# EAGLE design alpha85+mem+acia+pio-routed (EAGLE 9.0.0)
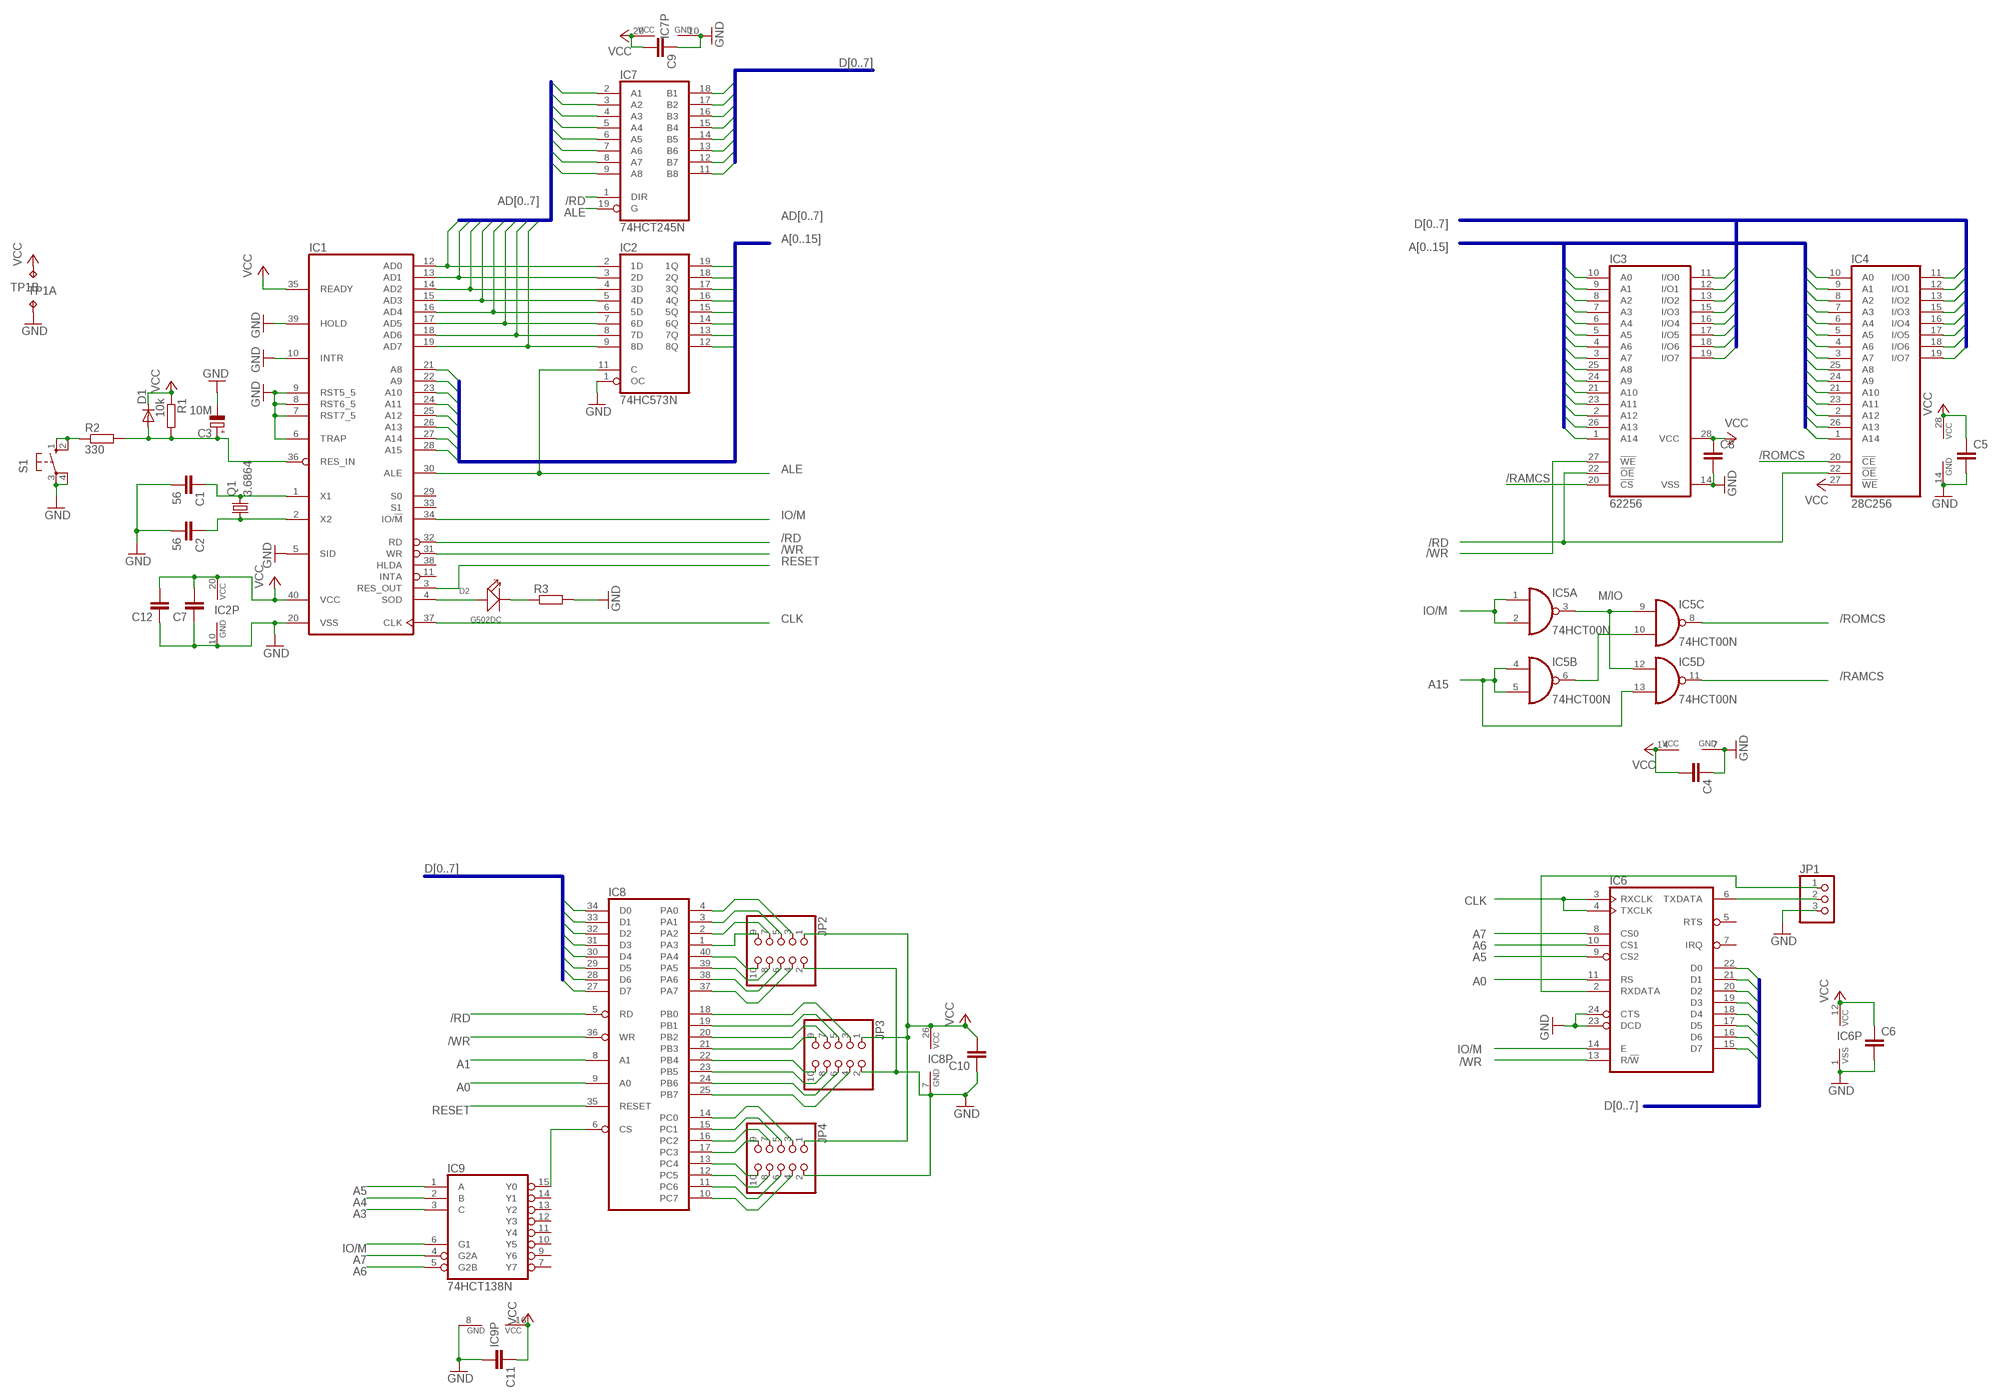
[diagram p0: schematic, sheet 1]

## Parts
C1  56  C-EU025-040X050  [C025-040X050]
C2  56  C-EU025-040X050  [C025-040X050]
C3  10M  CPOL-EUE5-8.5  [E5-8,5]
C4  C-EU050-025X075  [C050-025X075]
C5  C-EU050-025X075  [C050-025X075]
C6  C-EU050-025X075  [C050-025X075]
C7  C-EU050-025X075  [C050-025X075]
C8  C-EU050-025X075  [C050-025X075]
C9  C-EU050-025X075  [C050-025X075]
C10  C-EU050-025X075  [C050-025X075]
C11  C-EU050-025X075  [C050-025X075]
C12  C-EU050-025X075  [C050-025X075]
D1  1N4004  [DO41-10]
D2  G502DC  DIP-LED-GREEN-GREEN(2P-D5MM)  [LED2-2.54-D5.0MM]
IC1  8085  [DIL40]
IC2  74HC573N  [DIL20]
IC3  62256  62256P  [DIL28-6]
IC4  28C256  [DIL28]
IC5  74HCT00N  [DIL14]
IC6  6850  [DIL24]
IC7  74HCT245N  [DIL20]
IC8  8255A  [DIL40]
IC9  74HCT138N  [DIL16]
JP1  PINHD-1X3  [1X03]
JP2  PINHD-2X5  [2X05]
JP3  PINHD-2X5  [2X05]
JP4  PINHD-2X5  [2X05]
Q1  3.6864  CRYSTALHC49S  [HC49/S]
R1  10k  R-EU_0207/10  [0207/10]
R2  330  R-EU_0207/10  [0207/10]
R3  R-EU_0207/7  [0207/7]
S1  40-XX  [B3F-40XX]
TP1  TP2P2-38-17  [P2-38-17]

## Nets
/RAMCS: IC3.20(!CS) IC5.11(D:O)
/RD: IC1.32(RD) IC3.22(!OE) IC4.22(!OE) IC7.1(DIR) IC8.5(RD)
/ROMCS: IC4.20(!CE) IC5.8(C:O)
/WR: IC1.31(WR) IC3.27(!WE) IC6.13(R/!W) IC8.36(WR)
A0: IC2.19(1Q) IC3.10(A0) IC4.10(A0) IC6.11(RS) IC8.9(A0)
A1: IC2.18(2Q) IC3.9(A1) IC4.9(A1) IC8.8(A1)
A2: IC2.17(3Q) IC3.8(A2) IC4.8(A2)
A3: IC2.16(4Q) IC3.7(A3) IC4.7(A3) IC9.3(C)
A4: IC2.15(5Q) IC3.6(A4) IC4.6(A4) IC9.2(B)
A5: IC2.14(6Q) IC3.5(A5) IC4.5(A5) IC6.9(CS2) IC9.1(A)
A6: IC2.13(7Q) IC3.4(A6) IC4.4(A6) IC6.10(CS1) IC9.5(G2B)
A7: IC2.12(8Q) IC3.3(A7) IC4.3(A7) IC6.8(CS0) IC9.4(G2A)
A8: IC1.21(A8) IC3.25(A8) IC4.25(A8)
A9: IC1.22(A9) IC3.24(A9) IC4.24(A9)
A10: IC1.23(A10) IC3.21(A10) IC4.21(A10)
A11: IC1.24(A11) IC3.23(A11) IC4.23(A11)
A12: IC1.25(A12) IC3.2(A12) IC4.2(A12)
A13: IC1.26(A13) IC3.26(A13) IC4.26(A13)
A14: IC1.27(A14) IC3.1(A14) IC4.1(A14)
A15: IC1.28(A15) IC5.4(B:I0) IC5.5(B:I1) IC5.13(D:I1)
ALE: IC1.30(ALE) IC2.11(C) IC7.19(G)
CLK: IC1.37(CLK) IC6.3(RXCLK) IC6.4(TXCLK)
D0: IC3.11(I/O0) IC4.11(I/O0) IC6.22(D0) IC7.18(B1) IC8.34(D0)
D1: IC3.12(I/O1) IC4.12(I/O1) IC6.21(D1) IC7.17(B2) IC8.33(D1)
D2: IC3.13(I/O2) IC4.13(I/O2) IC6.20(D2) IC7.16(B3) IC8.32(D2)
D3: IC3.15(I/O3) IC4.15(I/O3) IC6.19(D3) IC7.15(B4) IC8.31(D3)
D4: IC3.16(I/O4) IC4.16(I/O4) IC6.18(D4) IC7.14(B5) IC8.30(D4)
D5: IC3.17(I/O5) IC4.17(I/O5) IC6.17(D5) IC7.13(B6) IC8.29(D5)
D6: IC3.18(I/O6) IC4.18(I/O6) IC6.16(D6) IC7.12(B7) IC8.28(D6)
D7: IC3.19(I/O7) IC4.19(I/O7) IC6.15(D7) IC7.11(B8) IC8.27(D7)
DX0: IC1.12(AD0) IC2.2(1D) IC7.2(A1)
DX1: IC1.13(AD1) IC2.3(2D) IC7.3(A2)
DX2: IC1.14(AD2) IC2.4(3D) IC7.4(A3)
DX3: IC1.15(AD3) IC2.5(4D) IC7.5(A4)
DX4: IC1.16(AD4) IC2.6(5D) IC7.6(A5)
DX5: IC1.17(AD5) IC2.7(6D) IC7.7(A6)
DX6: IC1.18(AD6) IC2.8(7D) IC7.8(A7)
DX7: IC1.19(AD7) IC2.9(8D) IC7.9(A8)
GND [gnd]: C1.2 C2.2 C3.- C4.1 C5.2 C6.2 C7.1 C8.2 C9.1 C10.1 C11.2 C12.1 IC1.5(SID) IC1.6(TRAP) IC1.7(RST7_5) IC1.8(RST6_5) IC1.9(RST5_5) IC1.10(INTR) IC1.20(VSS) IC1.39(HOLD) IC2.1(OC) IC2.10(GND) IC3.14(VSS) IC4.14(GND) IC5.7(P:GND) IC6.1(VSS) IC6.23(DCD) IC6.24(CTS) IC7.10(GND) IC8.7(GND) IC9.8(GND) JP1.3 JP2.2 JP3.2 JP4.2 R3.2 S1.3(P) S1.4(P1) TP1.TP-1
IO/M: IC1.34(IO/!M) IC5.1(A:I0) IC5.2(A:I1) IC6.14(E) IC9.6(G1)
M/IO: IC5.3(A:O) IC5.9(C:I0) IC5.12(D:I0)
N$1: C1.1 IC1.1(X1) Q1.2
N$2: C2.1 IC1.2(X2) Q1.1
N$3: D2.+ IC1.4(SOD)
N$4: D2.- R3.1
N$5: IC6.6(TXDATA) JP1.2
N$6: C3.+ D1.A IC1.36(RES_IN) R1.2 R2.2
N$7: R2.1 S1.1(S) S1.2(S1)
N$8: IC5.6(B:O) IC5.10(C:I1)
N$9: IC8.1(PA3) JP2.9
N$10: IC6.2(RXDATA) JP1.1
N$11: IC8.2(PA2) JP2.7
N$12: IC8.3(PA1) JP2.5
N$13: IC8.4(PA0) JP2.3
N$14: IC8.40(PA4) JP2.10
N$15: IC8.39(PA5) JP2.8
N$16: IC8.38(PA6) JP2.6
N$17: IC8.37(PA7) JP2.4
N$18: IC8.21(PB3) JP3.9
N$19: IC8.20(PB2) JP3.7
N$20: IC8.19(PB1) JP3.5
N$21: IC8.18(PB0) JP3.3
N$22: IC8.22(PB4) JP3.10
N$23: IC8.23(PB5) JP3.8
N$24: IC8.24(PB6) JP3.6
N$25: IC8.25(PB7) JP3.4
N$26: IC8.17(PC3) JP4.9
N$27: IC8.13(PC4) JP4.10
N$28: IC8.16(PC2) JP4.7
N$29: IC8.15(PC1) JP4.5
N$30: IC8.14(PC0) JP4.3
N$31: IC8.12(PC5) JP4.8
N$32: IC8.11(PC6) JP4.6
N$33: IC8.10(PC7) JP4.4
N$36: IC8.6(CS) IC9.15(Y0)
RESET: IC1.3(RES_OUT) IC8.35(RESET)
VCC [gnd]: C4.2 C5.1 C6.1 C7.2 C8.1 C9.2 C10.2 C11.1 C12.2 D1.C IC1.35(READY) IC1.40(VCC) IC2.20(VCC) IC3.28(VCC) IC4.27(!WE) IC4.28(VCC) IC5.14(P:VCC) IC6.12(VCC) IC7.20(VCC) IC8.26(VCC) IC9.16(VCC) JP2.1 JP3.1 JP4.1 R1.1 TP1.TP-2
Unconnected: IC1.11(INTA) IC1.29(S0) IC1.33(S1) IC1.38(HLDA) IC6.5(RTS) IC6.7(IRQ) IC9.7(Y7) IC9.9(Y6) IC9.10(Y5) IC9.11(Y4) IC9.12(Y3) IC9.13(Y2) IC9.14(Y1)

## Buses
A[0..15]
D[0..7]
AD[0..7]

## Library data of the parts
C1 C2 C4-C12 = rcl:C-EU: CAPACITOR, European symbol
C3 = rcl:CPOL-EU: POLARIZED CAPACITOR, European symbol
D1 = diode:1N4004: DIODE general purpose rectifier, 1 A
D2 = Seeed-LED:DIP-LED-GREEN-GREEN(2P-D5MM): 304090038; MPN: G502DC
IC1 = micro-intel:8085: MICROCOMPUTER/PERIPHERAL DEVICE; OC_FARNELL: unknown; OC_NEWARK: unknown
IC2 = 74xx-eu:74*573: 8-bit D latch BUS DRIVER
IC3 = memory-hitachi:62256P: MEMORY; OC_FARNELL: unknown; OC_NEWARK: unknown
IC4 = memory:28C256: MEMORY
IC5 = 74xx-eu:74*00: Quad 2-input NAND gate
IC6 = micro-motorola:6850: MICROCONTROLLER/MEMORY DEVICE; MF: NTE ELECTRONICS; MPN: NTE6850; OC_FARNELL: 4899775; OC_NEWARK: 31C2457
IC7 = 74xx-eu:74*245: Octal BUS TRANSCEIVER, 3-state
IC8 = micro-intel:8255A: MICROCOMPUTER/PERIPHERAL DEVICE; OC_FARNELL: unknown; OC_NEWARK: unknown
IC9 = 74xx-eu:74*138: 3-line to 8-line DECODER/DEMULTIPLEXER
JP1 = pinhead:PINHD-1X3: PIN HEADER
JP2-JP4 = pinhead:PINHD-2X5: PIN HEADER
Q1 = crystal:CRYSTAL: CRYSTAL; OC_FARNELL: 1667008; OC_NEWARK: unknown
R1-R3 = rcl:R-EU_: RESISTOR, European symbol
S1 = adafruit:40-XX: OMRON SWITCH; MF: OMRON COMPONENTS USA; MPN: B3F-4000; OC_FARNELL: 176434; OC_NEWARK: 36K3105
TP1 = testpad:TP2: Test pad

## Net classes
0 default: width 0.305 mm
1 gnd: width 0.61 mm

## Board
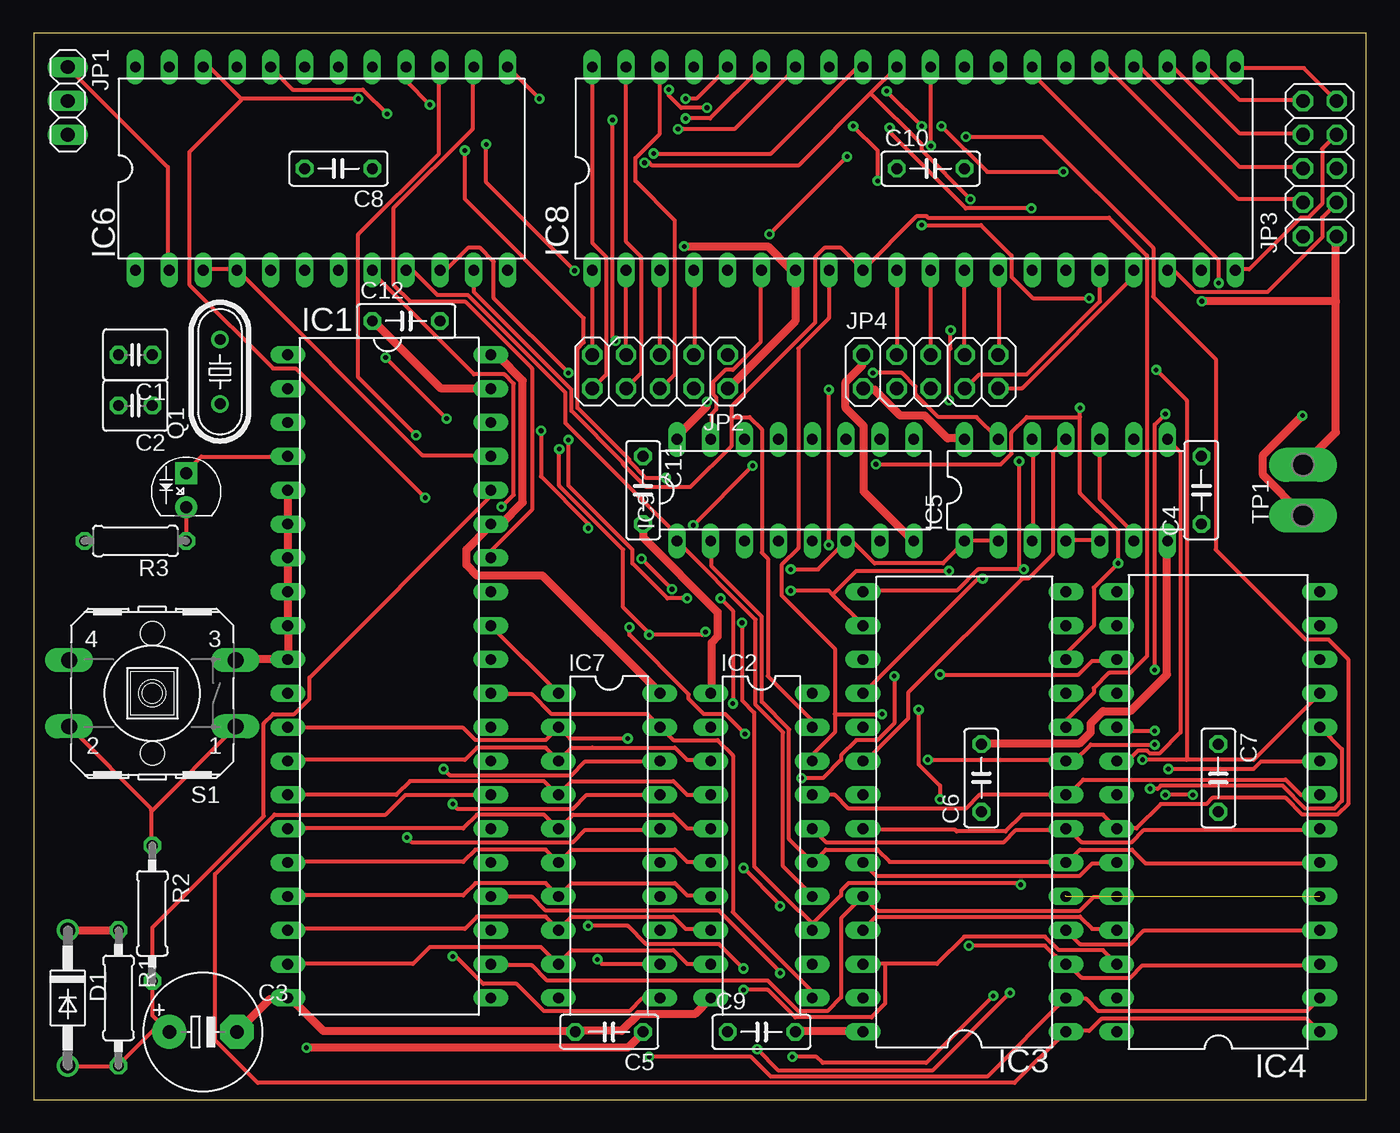
[diagram p1: board, top side]
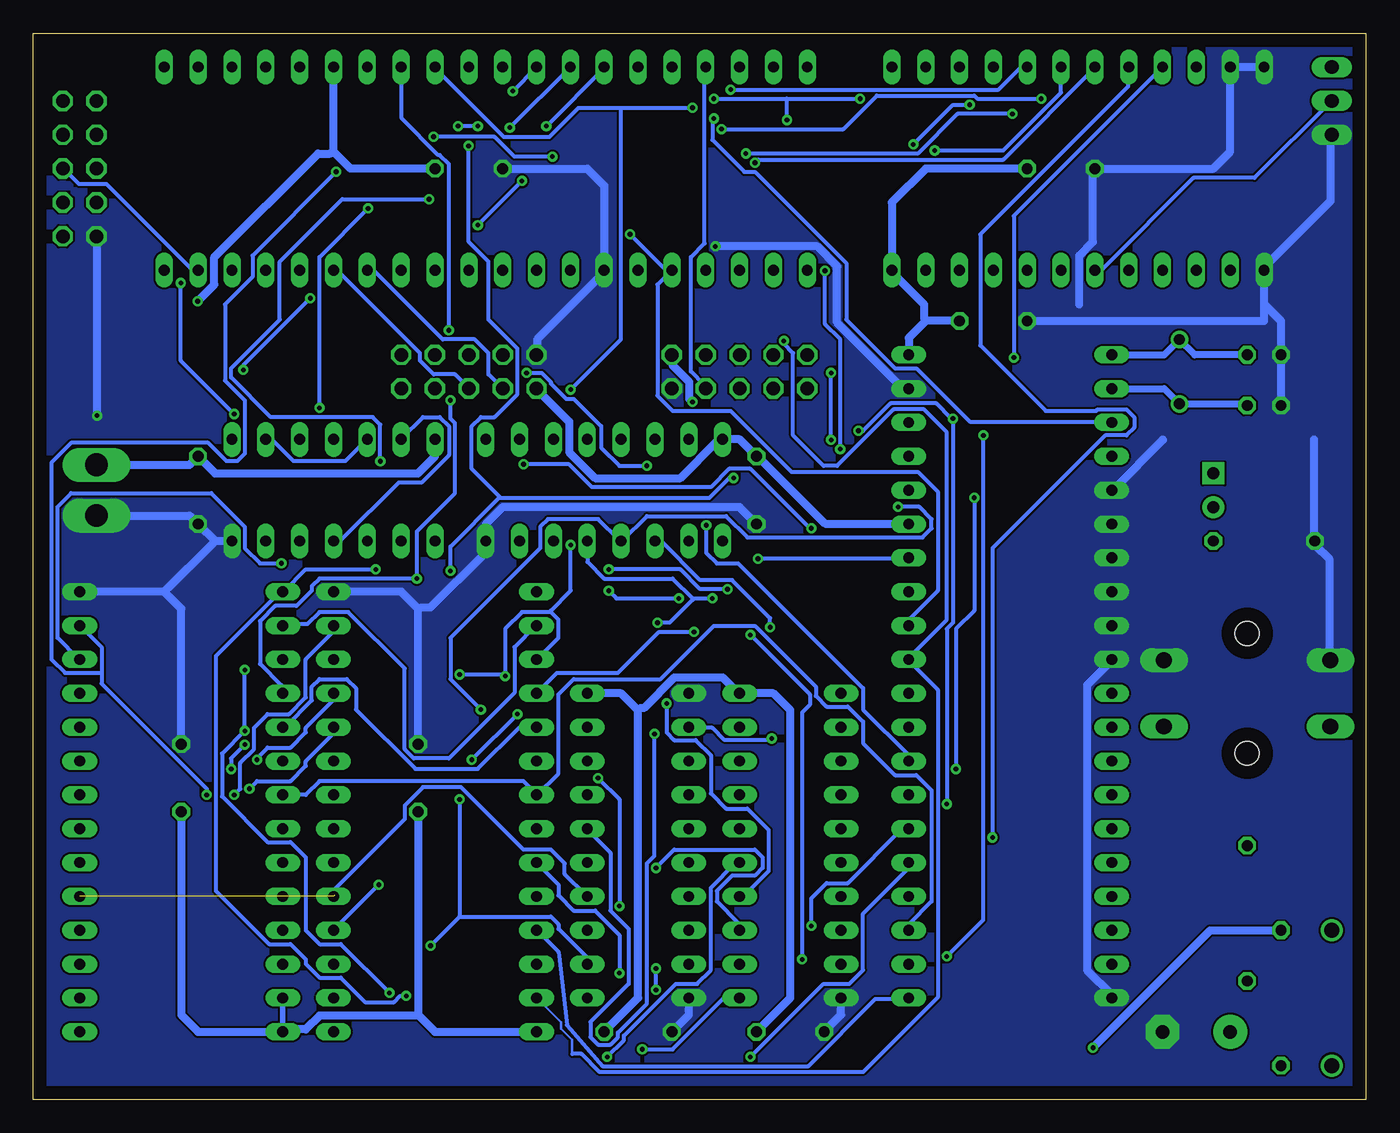
[diagram p2: board, bottom side, seen from below]

Size 100 x 80 mm. Coordinates in mm from the lower left corner, seen from the top.
Outline: 0,0 100,0 100,80 0,80 0,0
Copper layers (1*16): Top 0.035mm / dielectric 1.5mm / Bottom 0.035mm
Design rules "default": minimum track width 6mil, minimum drill 0.35mm, track to track 6mil, track to pad 6mil, pad to pad 6mil, via to via 6mil, smd to smd 6mil, copper to edge 40mil, drill to drill 6mil, minimum pad ring 10mil, minimum via ring 8mil, stop-mask expansion 4mil, vias tented up to drill 0mil, thermal gap 10mil

### Footprints (pad centres in the part's own frame; a part is rotated, then mirrored left to right if it is on the bottom)
C025-040X050 = drill 0.813 octagon: 1 -1.27,0; 2 1.27,0
E5-8,5 = drill 1.016 pad 2.54: + -2.54,0 | drill 1.016 pad 2.54 octagon: - 2.54,0
C050-025X075 = drill 0.813 octagon: 1 -2.54,0; 2 2.54,0
DO41-10 = drill 1.118: A 5.08,0; C -5.08,0
LED2-2.54-D5.0MM = drill 0.889 pad 1.651 square: + -1.27,0 | drill 0.889 pad 1.651: - 1.27,0
DIL40 = drill 0.813 long: 1 -24.13,-7.62; 2 -21.59,-7.62; 3 -19.05,-7.62; 4 -16.51,-7.62; 5 -13.97,-7.62; 6 -11.43,-7.62; 7 -8.89,-7.62; 8 -6.35,-7.62; 9 -3.81,-7.62; 10 -1.27,-7.62; 11 1.27,-7.62; 12 3.81,-7.62; 13 6.35,-7.62; 14 8.89,-7.62; 15 11.43,-7.62; 16 13.97,-7.62; 17 16.51,-7.62; 18 19.05,-7.62; 19 21.59,-7.62; 20 24.13,-7.62; 21 24.13,7.62; 22 21.59,7.62; 23 19.05,7.62; 24 16.51,7.62; 25 13.97,7.62; 26 11.43,7.62; 27 8.89,7.62; 28 6.35,7.62; 29 3.81,7.62; 30 1.27,7.62; 31 -1.27,7.62; 32 -3.81,7.62; 33 -6.35,7.62; 34 -8.89,7.62; 35 -11.43,7.62; 36 -13.97,7.62; 37 -16.51,7.62; 38 -19.05,7.62; 39 -21.59,7.62; 40 -24.13,7.62
DIL20 = drill 0.813 long: 1 -11.43,-3.81; 2 -8.89,-3.81; 3 -6.35,-3.81; 4 -3.81,-3.81; 5 -1.27,-3.81; 6 1.27,-3.81; 7 3.81,-3.81; 8 6.35,-3.81; 9 8.89,-3.81; 10 11.43,-3.81; 11 11.43,3.81; 12 8.89,3.81; 13 6.35,3.81; 14 3.81,3.81; 15 1.27,3.81; 16 -1.27,3.81; 17 -3.81,3.81; 18 -6.35,3.81; 19 -8.89,3.81; 20 -11.43,3.81
DIL28-6 = drill 0.813 long: 1 -16.51,-7.62; 2 -13.97,-7.62; 3 -11.43,-7.62; 4 -8.89,-7.62; 5 -6.35,-7.62; 6 -3.81,-7.62; 7 -1.27,-7.62; 8 1.27,-7.62; 9 3.81,-7.62; 10 6.35,-7.62; 11 8.89,-7.62; 12 11.43,-7.62; 13 13.97,-7.62; 14 16.51,-7.62; 15 16.51,7.62; 16 13.97,7.62; 17 11.43,7.62; 18 8.89,7.62; 19 6.35,7.62; 20 3.81,7.62; 21 1.27,7.62; 22 -1.27,7.62; 23 -3.81,7.62; 24 -6.35,7.62; 25 -8.89,7.62; 26 -11.43,7.62; 27 -13.97,7.62; 28 -16.51,7.62
DIL28 = drill 0.813 long: 1 -16.51,-7.62; 2 -13.97,-7.62; 3 -11.43,-7.62; 4 -8.89,-7.62; 5 -6.35,-7.62; 6 -3.81,-7.62; 7 -1.27,-7.62; 8 1.27,-7.62; 9 3.81,-7.62; 10 6.35,-7.62; 11 8.89,-7.62; 12 11.43,-7.62; 13 13.97,-7.62; 14 16.51,-7.62; 15 16.51,7.62; 16 13.97,7.62; 17 11.43,7.62; 18 8.89,7.62; 19 6.35,7.62; 20 3.81,7.62; 21 1.27,7.62; 22 -1.27,7.62; 23 -3.81,7.62; 24 -6.35,7.62; 25 -8.89,7.62; 26 -11.43,7.62; 27 -13.97,7.62; 28 -16.51,7.62
DIL14 = drill 0.813 long: 1 -7.62,-3.81; 2 -5.08,-3.81; 3 -2.54,-3.81; 4 0,-3.81; 5 2.54,-3.81; 6 5.08,-3.81; 7 7.62,-3.81; 8 7.62,3.81; 9 5.08,3.81; 10 2.54,3.81; 11 0,3.81; 12 -2.54,3.81; 13 -5.08,3.81; 14 -7.62,3.81
DIL24 = drill 0.813 long: 1 -13.97,-7.62; 2 -11.43,-7.62; 3 -8.89,-7.62; 4 -6.35,-7.62; 5 -3.81,-7.62; 6 -1.27,-7.62; 7 1.27,-7.62; 8 3.81,-7.62; 9 6.35,-7.62; 10 8.89,-7.62; 11 11.43,-7.62; 12 13.97,-7.62; 13 13.97,7.62; 14 11.43,7.62; 15 8.89,7.62; 16 6.35,7.62; 17 3.81,7.62; 18 1.27,7.62; 19 -1.27,7.62; 20 -3.81,7.62; 21 -6.35,7.62; 22 -8.89,7.62; 23 -11.43,7.62; 24 -13.97,7.62
DIL16 = drill 0.813 long: 1 -8.89,-3.81; 2 -6.35,-3.81; 3 -3.81,-3.81; 4 -1.27,-3.81; 5 1.27,-3.81; 6 3.81,-3.81; 7 6.35,-3.81; 8 8.89,-3.81; 9 8.89,3.81; 10 6.35,3.81; 11 3.81,3.81; 12 1.27,3.81; 13 -1.27,3.81; 14 -3.81,3.81; 15 -6.35,3.81; 16 -8.89,3.81
1X03 = drill 1.016 long: 1 -2.54,0; 2 0,0; 3 2.54,0
2X05 = drill 1.016 octagon: 1 -5.08,-1.27; 2 -5.08,1.27; 3 -2.54,-1.27; 4 -2.54,1.27; 5 0,-1.27; 6 0,1.27; 7 2.54,-1.27; 8 2.54,1.27; 9 5.08,-1.27; 10 5.08,1.27
HC49/S = drill 0.813: 1 -2.413,0; 2 2.413,0
0207/10 = drill 0.813 octagon: 1 -5.08,0; 2 5.08,0
0207/7 = drill 0.813 octagon: 1 -3.81,0; 2 3.81,0
B3F-40XX = drill 1.194 long: 1 -6.248,2.489; 2 6.248,2.489; 3 -6.248,-2.489; 4 6.248,-2.489 | hole 1.803: 0,-4.496; 0,4.496
P2-38-17 = drill 1.702 pad 2.121 long: TP-1 -1.905,0; TP-2 1.905,0

### Placement (x,y rotation side)
C1  7.62,55.88 180 top
C2  7.62,52.07 180 top
C3  12.7,5.08 0 top
C4  87.63,45.72 90 top
C5  43.18,5.08 180 top
C6  71.12,24.13 90 top
C7  88.9,24.13 270 top
C8  22.86,69.85 180 top
C9  54.61,5.08 0 top
C10  67.31,69.85 0 top
C11  45.72,45.72 270 top
C12  27.94,58.42 0 top
D1  2.54,7.62 270 top
D2  11.43,45.72 270 top
IC1  26.67,31.75 270 top
IC2  54.61,19.05 270 top
IC3  69.85,21.59 90 top
IC4  88.9,21.59 90 top
IC5  77.47,45.72 0 top
IC6  21.59,69.85 0 top
IC7  43.18,19.05 270 top
IC8  66.04,69.85 0 top
IC9  57.15,45.72 0 top
JP1  2.54,74.93 270 top
JP2  46.99,54.61 180 top
JP3  96.52,69.85 90 top
JP4  67.31,54.61 0 top
Q1  13.97,54.61 90 top
R1  6.35,7.62 270 top
R2  8.89,13.97 270 top
R3  7.62,41.91 180 top
S1  8.89,30.48 180 top
TP1  95.25,45.72 90 top

### Tracks (layer width: path | path; a pad name or v marks a point on that pad's centre or on a via)
/RAMCS
  Top 0.305: IC3.20 62.29,25.49 62.52,25.49 65.61,28.57 65.61,30.52 74.18,39.09 74.64,39.09 76.47,40.92 76.47,48.58 77.38,49.49 IC5.11
/RD  (via drill 0.35)
  Top 0.305: IC3.22 62.29,20.23 69.15,20.23 69.27,20.12 72.92,20.12 74.18,21.37 80.24,21.37 81.27,20.34 IC4.22 81.38,20.34 82.75,20.34 84.58,22.17 88.01,22.17 88.47,22.63 93.95,22.63 95.21,21.37 97.84,21.37 98.64,22.17 98.64,33.03 97.16,34.52 95.44,34.52 88.7,41.26 88.7,55.55 84.01,60.24 84.01,63.89 75.67,72.24 v69.95,72.24 | v55.21,64.92 v61.04,70.75 | IC1.32 IC7.1
  Bottom 0.305: IC1.32 34.29,36.01 32.12,38.18 32.12,45.61 33.6,47.09 43.09,47.09 47.66,51.66 52.01,51.66 53.15,52.81 53.15,61.15 IC8.5 52.35,62.06 v55.21,64.92 | v69.95,72.24 65.38,72.24 63.89,70.75 v61.04,70.75
/ROMCS
  Top 0.305: IC4.20 81.38,25.49 82.18,25.49 82.87,26.18 83.55,26.18 83.78,25.95 84.47,25.95 86.07,27.55 86.07,48.58 85.15,49.49 IC5.8
/WR  (via drill 0.35)
  Top 0.305: v37.95,75.09 35.66,77.38 IC6.13 | v48.92,75.09 49.72,75.09 52.01,77.38 IC8.36 | 34.29,32.92 IC1.31 | v43.43,73.5 43.43,57.15 v43.66,56.92
  Bottom 0.203: 59.55,3.43 59.55,4.47 60.4,5.32 60.4,5.79 IC3.27
  Bottom 0.305: v48.92,75.09 43.43,75.09 | 43.43,75.09 v37.95,75.09 | 59.55,3.43 58.86,3.43 57.49,2.06 37.72,2.06 32.12,7.66 32.12,30.75 34.29,32.92 IC1.31 34.29,33.15 31.43,36.01 31.43,50.06 33.15,51.78 35.43,51.78 39.66,47.55 40.69,47.55 42.98,49.84 42.98,56.01 43.66,56.69 v43.66,56.92 | v43.43,73.5 43.43,75.09
A0  (via drill 0.35)
  Top 0.305: v83.78,23.32 84.35,23.32 84.58,23.55 93.73,23.55 95.44,21.83 97.61,21.83 98.18,22.4 98.18,26.29 96.58,27.89 IC4.10 | 52.35,51.21 52.35,52.01 58.64,58.29 58.64,63.21 59.32,63.89 60.58,63.89 62.18,62.29 IC8.9 66.29,66.29 66.98,66.29 67.09,66.18 80.7,66.18 83.55,63.32 83.55,33.26 82.3,32 80.7,32 79.55,30.86 79.55,30.52 77.5,28.46 77.5,28 IC3.10 | 52.35,51.21 52.35,49.03 49.26,45.95 45.95,45.95 44.23,47.66 44.23,47.78 40.35,51.66 40.35,53.26 33.03,60.58 33.03,62.18 IC6.11 | 52.35,51.21 53.72,51.21 54.63,50.29 54.63,41.03 55.09,40.58 55.09,31.77 58.41,28.46 58.41,28 IC2.19
  Bottom 0.305: v83.78,23.32 83.21,23.89 80.7,23.89 79.55,25.03 79.55,25.38 77.5,27.43 77.5,27.89 IC3.10
A1  (via drill 0.35)
  Top 0.305: 60.12,28.92 60.12,33.83 56.12,37.83 56.12,40.12 57.38,41.38 57.38,56.35 59.66,58.64 59.66,62.18 IC8.8 | 60.12,28.92 60.12,27.55 58.52,25.95 58.52,25.49 IC2.18 | v67.09,25.49 77.38,25.49 IC3.9 77.61,25.38 78.07,25.38 79.32,26.63 v84.12,26.63 | 60.12,28.92 v63.66,28.92 | v85.15,24.8 91.55,24.8 92.13,25.38 96.47,25.38 IC4.9
  Bottom 0.305: v63.66,28.92 v67.09,25.49 | v85.15,24.8 85.15,25.6 v84.12,26.63
A2
  Top 0.305: IC2.17 60.12,22.86 61.15,21.83 69.95,21.83 70.98,22.86 IC3.8 77.61,22.86 78.75,24 93.95,24 95.1,22.86 IC4.8
A3  (via drill 0.35)
  Top 0.305: v44.69,35.43 44.69,34.86 49.15,30.4 49.15,30.06 50.29,28.92 51.89,28.92 v53.38,27.43 | IC2.16 58.52,20.23 59.44,19.32 72.81,19.32 73.72,20.23 77.38,20.23 IC3.7 77.61,20.34 78.64,19.32 82.41,19.32 83.33,20.23 96.47,20.23 IC4.7
  Bottom 0.305: v44.69,35.43 44.69,36.12 47.55,38.98 49.95,38.98 52.81,41.83 53.26,41.83 IC9.3 | v53.38,27.43 53.38,18.29 53.95,17.72 53.95,7.2 56.12,5.03 56.12,4.69 56.69,4.12 57.61,4.12 58.18,4.69 58.18,5.83 55.32,8.69 55.32,12.8 56.69,14.17 56.69,18.52 58.41,20.23 IC2.16
A4
  Top 0.305: 96.47,17.72 IC4.6 96.36,17.72 83.44,17.72 82.41,18.75 78.52,18.75 77.61,17.83 IC3.6 77.38,17.83 64.24,17.83 63.32,18.75 59.44,18.75 58.52,17.83 IC2.15 58.41,17.83 56.69,19.55 56.69,27.77 54.63,29.83 54.63,36.23 50.86,40.01 50.86,41.83 IC9.2
A5  (2 unrouted)
  Top 0.305: IC2.14 58.41,15.32 56.24,17.49 56.24,27.55 54.18,29.6 54.18,36.01 48.35,41.83 IC9.1 48.12,41.95 48.12,42.52 39.89,50.75 39.89,53.03 32.58,60.35 30.29,60.35 28.46,62.18 28,62.18 IC6.9
  Bottom 0.305: 77.38,15.32 77.38,15.77 72.12,21.03 72.12,22.06 70.75,23.43 67.89,23.43 63.21,18.75 61.15,18.75 60.12,17.72 60.12,16.92 58.52,15.32 IC2.14
A6  (via drill 0.35)
  Top 0.305: v74.07,16.12 73.95,16.23 61.15,16.23 60.58,15.66 60.58,15.32 58.52,13.26 58.52,12.8 IC2.13 58.41,13.26 57.49,14.17 57.38,14.17 54.06,17.49 54.06,29.03 53.15,29.95 v53.15,35.78 | IC4.4 96.47,12.69 83.33,12.69 82.3,11.66 78.52,11.66 77.5,12.69 IC3.4 | v40.12,54.52 34.52,60.12 34.52,62.87 33.49,63.89 32.58,63.89 30.98,62.29 30.52,62.29 IC6.10 | v40.12,49.49 40.12,46.06 44.92,41.26 44.92,40.23 47.55,37.6 v49.03,37.6
  Bottom 0.305: v74.07,16.12 77.38,12.8 IC3.4 | v40.12,49.49 v40.12,54.52 | 50.52,37.6 v49.03,37.6 | 50.52,37.6 52.01,39.09 57.15,39.09 58.41,40.35 58.41,41.83 IC9.5 | v53.15,35.78 52.23,35.78 50.52,37.49 50.52,37.6
A7  (via drill 0.35)
  Top 0.305: v70.18,11.54 75.89,11.54 77.38,10.06 IC3.3 77.61,10.17 78.64,9.14 82.3,9.14 83.21,10.06 96.47,10.06 IC4.3 | v35.09,44.46 36.01,45.38 36.01,53.72 35.32,54.41 33.03,54.41 25.49,61.95 25.49,62.18 IC6.8 | v68.01,22.52 68.01,23.55 66.41,25.15 v66.41,29.26
  Bottom 0.305: 68.01,13.72 61.15,13.72 60.58,13.14 60.58,12.8 58.52,10.74 58.52,10.17 IC2.12 | v70.18,11.54 68.01,13.72 | v35.09,44.46 33.49,44.46 32.58,43.55 32.58,42.86 33.26,42.18 46.41,42.18 48.01,43.78 53.95,43.78 55.78,41.95 IC9.4 56.01,41.95 57.61,43.55 61.38,43.55 61.95,42.98 61.95,41.38 68.69,34.63 68.69,31.55 v66.41,29.26 | v68.01,22.52 68.01,13.72
A8
  Top 0.305: IC4.25 81.27,12.8 79.44,12.8 78.52,13.72 63.21,13.72 62.29,12.8 IC3.25
  Bottom 0.305: IC1.21 34.29,7.54 36.8,7.54 41.83,2.52 57.26,2.52 59.94,5.58 60.58,11.09 62.18,12.69 IC3.25
A9
  Top 0.305: IC1.22 34.29,10.06 37.38,10.06 38.52,8.91 55.09,8.91 57.38,6.63 59.55,6.63 60.58,7.66 60.58,13.6 62.18,15.2 IC3.24 62.29,15.2 63.32,14.17 78.52,14.17 79.55,15.2 81.27,15.2 IC4.24
A10
  Bottom 0.305: IC1.23 34.29,13.14 32.58,14.86 32.58,23.2 33.72,24.35 35.32,24.35 37.72,26.75 37.72,28.35 38.86,29.49 40.46,29.49 41.26,30.29 41.26,30.98 45.83,35.55 48.92,35.55 52.92,31.55 59.44,31.55 60.58,30.4 60.58,24.46 62.18,22.86 IC3.21 62.29,22.97 63.21,23.89 78.52,23.89 79.55,22.86 IC4.21
A11  (via drill 0.35)
  Top 0.305: v56.01,9.49 56.01,9.6 51.44,14.17 38.41,14.17 37.38,15.2 34.29,15.2 IC1.24 | IC3.23 63.21,16.8 78.52,16.8 79.44,17.72 81.27,17.72 IC4.23
  Bottom 0.305: v56.01,9.49 56.01,12.34 57.84,14.17 59.44,14.17 60.58,15.32 60.58,16.12 62.18,17.72 IC3.23
A12  (via drill 0.35)
  Top 0.305: IC4.2 96.47,7.54 95.56,6.63 79.9,6.63 78.98,7.54 77.5,7.54 IC3.2 77.38,7.54 71.55,1.71 55.32,1.71 53.84,3.2 v46.18,3.2
  Bottom 0.305: IC1.25 34.29,17.37 37.72,13.95 37.72,9.72 38.75,8.69 40.69,8.69 v46.18,3.2
A13  (via drill 0.35)
  Top 0.305: 63.89,10.17 67.78,10.17 69.84,12.23 75.89,12.23 76.92,11.2 80.24,11.2 IC4.26 | 63.89,10.17 62.29,10.17 IC3.26 | v41.6,13.03 44.58,13.03 45.95,11.66 51.44,11.66 v53.26,9.83 | v53.26,8.23 55.09,8.23 57.15,6.17 62.87,6.17 63.89,7.2 63.89,10.17
  Bottom 0.305: v41.6,13.03 41.6,15.09 40.46,16.23 38.86,16.23 34.86,20.23 34.29,20.23 IC1.26 | v53.26,8.23 v53.26,9.83
A14
  Top 0.305: IC4.1 96.47,5.14 95.56,6.06 80.12,6.06 79.21,5.14 77.5,5.14 IC3.1 77.38,5.03 73.61,1.26 16.8,1.26 13.6,4.46 13.6,16.92 18.06,21.37 26.4,21.37 27.89,22.86 IC1.27
A15  (via drill 0.35)
  Top 0.305: IC5.4 77.5,41.95 80.01,41.95 IC5.5 | v53.95,47.55 v49.49,43.09 | v62.98,54.52 65.15,54.52 66.18,53.49 66.18,52.92 67.89,51.21 70.75,51.21 72.35,49.61 IC5.13
  Bottom 0.305: IC1.28 34.29,25.83 37.72,29.26 37.72,30.86 47.09,40.23 48.69,40.23 49.49,41.03 v49.49,43.09 | v53.95,47.55 56.01,47.55 57.38,48.92 57.38,50.52 59.44,52.58 60.01,52.58 61.15,53.72 61.15,53.84 61.84,54.52 v62.98,54.52 | IC5.4 77.38,41.95 76.92,41.95 72.58,46.29 70.87,46.29 68.81,48.35 68.81,50.52 69.49,51.21 70.75,51.21 72.35,49.61 IC5.13
ALE
  Top 0.305: IC1.30 34.29,30.4 37.38,30.4 38.86,28.92 46.06,28.92 46.98,28 IC7.19 47.09,27.89 48.01,26.98 51.32,26.98 52.46,25.83 52.46,14.06 58.41,8.12 58.41,7.66 IC2.11
CLK
  Top 0.305: IC6.3 12.8,62.29 15.2,62.29 IC6.4 15.32,62.18 29.15,48.35 34.29,48.35 IC1.37
D0  (via drill 0.35)
  Top 0.305: 86.53,25.49 91.55,25.49 96.47,30.4 IC4.11 | 86.53,25.49 v83.21,25.49 | 15.54,75.09 13.26,77.38 12.8,77.38 IC6.22 | v24.35,75.09 15.54,75.09 | v48.35,72.81 52.58,72.81 57.15,77.38 IC8.34 | v30.75,24.8 31.2,24.35 40.35,24.35 41.38,25.38 46.98,25.38 IC7.18 | v29.38,45.15 19.66,54.86 17.95,54.86 11.66,61.15 11.66,71.09 15.54,74.98 15.54,75.09 | 86.53,25.49 86.53,52.46 v84.24,54.75 | v79.21,60.12 74.98,60.12 73.38,61.72 73.38,63.32 71.09,65.61 v66.64,65.61 | v63.32,68.92 63.32,71.21 v61.49,73.04
  Bottom 0.305: v83.21,25.49 83.21,25.6 82.41,26.4 80.7,26.4 79.55,27.55 79.55,27.89 77.5,29.95 77.5,30.4 IC3.11 | v24.35,75.09 29.15,75.09 29.38,75.32 36.69,75.32 39.2,72.81 v48.35,72.81 | v30.75,24.8 30.75,35.32 29.38,36.69 v29.38,45.15 | v84.24,54.75 84.24,55.09 v79.21,60.12 | v63.32,68.92 v66.64,65.61 | v61.49,73.04 57.15,77.38 IC8.34
D1  (via drill 0.35)
  Top 0.305: IC3.12 77.5,33.03 77.5,33.49 79.55,35.55 79.55,38.41 v81.38,40.23 81.38,42.63 78.52,45.49 78.52,51.21 | v64.24,72.92 64.24,72.58 69.95,66.86 v74.87,66.86 | 78.52,51.21 v78.52,51.89 | IC7.17 41.49,22.86 40.46,21.83 31.77,21.83 v31.43,22.17 | v26.4,55.66 v30.98,51.09 | 78.52,51.21 74.52,51.21 73.38,50.06 73.38,48.46 72.58,47.66 v63.21,47.66 | v41.6,42.86 41.6,43.2 38.06,46.75 v38.06,50.18
  Bottom 0.305: v81.38,40.23 82.98,40.23 84.12,41.38 84.12,42.98 86.64,45.49 97.16,45.49 98.18,44.46 98.18,34.63 96.58,33.03 IC4.12 | v64.24,72.92 IC8.33 | v74.87,66.86 78.52,63.21 v78.52,51.89 | v31.43,22.17 31.43,35.32 30.98,35.78 v30.98,51.09 31.09,51.09 32.23,52.23 35.66,52.23 37.72,50.18 v38.06,50.18 | v26.4,55.66 26.4,66.29 15.32,77.38 IC6.21 | v63.21,47.66 59.78,47.66 58.06,45.95 49.15,45.95 47.78,47.32 46.18,47.32 41.72,42.86 v41.6,42.86
D2  (via drill 0.35)
  Top 0.305: v86.98,22.86 v84.92,22.86 | v28,19.66 28.35,19.32 40.46,19.32 41.38,20.23 46.98,20.23 IC7.16 | v46.52,70.98 55.32,70.98 61.72,77.38 62.18,77.38 IC8.32 | v26.52,73.95 24.69,75.78 19.43,75.78 17.83,77.38 IC6.20 | v77.27,69.61 71.55,69.61 v68.12,73.04 | v64.01,75.67 v66.64,73.04
  Bottom 0.305: v84.92,22.86 84.47,23.32 84.47,25.26 83.44,26.29 83.44,27.89 82.41,28.92 80.81,28.92 79.55,30.18 79.55,33.03 77.5,35.09 77.5,35.55 IC3.13 | v86.98,22.86 86.98,23.32 94.87,31.2 94.87,32 | 94.87,32 94.87,33.95 96.47,35.55 IC4.13 | v28,19.66 28,41.38 19.55,49.84 17.95,49.84 17.37,50.41 17.37,51.21 17.95,51.78 20.12,51.78 20.23,51.66 24,51.66 28.92,56.58 28.92,64.92 17.83,76.01 17.83,77.38 IC6.20 | v46.52,70.98 33.6,70.98 30.63,73.95 v26.52,73.95 | 94.87,32 97.61,32 98.64,33.03 98.64,47.78 97.16,49.26 86.87,49.26 85.5,47.89 84.7,47.89 84.12,48.46 84.12,52.46 85.61,53.95 85.61,59.66 83.55,61.72 83.55,63.32 v77.27,69.61 | v66.64,73.04 v68.12,73.04 | v64.01,75.67 62.29,77.38 IC8.32
D3  (via drill 0.35)
  Top 0.305: v45.83,70.29 46.18,70.29 46.41,70.07 57.38,70.07 62.81,75.5 | 62.81,75.5 64.69,77.38 IC8.31 | v56.92,3.2 58.75,3.2 59.21,2.74 66.98,2.74 v72.01,7.77 | IC3.15 62.29,38.18 69.27,38.18 70.87,39.78 v74.3,39.78 73.95,39.89 v73.95,47.89 | 62.81,75.5 66.64,71.67 66.64,71.21 v70.29,67.55
  Bottom 0.305: v45.83,70.29 45.61,70.52 27.2,70.52 20.34,77.38 IC6.19 | v56.92,3.2 55.66,4.46 55.66,4.8 51.78,8.69 50.18,8.69 49.15,9.72 49.15,15.89 47.32,17.72 47.09,17.72 IC7.15 | v72.01,7.77 72.47,7.77 72.92,7.32 75.09,7.32 76.92,9.14 78.52,9.14 79.55,10.17 79.55,10.52 80.7,11.66 82.3,11.66 86.3,15.66 86.3,33.26 81.38,38.18 IC4.15 81.15,38.18 79.55,39.78 v74.3,39.78 | v70.29,67.55 76.81,67.55 81.5,62.87 81.5,58.52 85.15,54.86 85.15,54.18 82.18,51.21 74.52,51.21 73.95,50.63 v73.95,47.89
D4  (via drill 0.35)
  Top 0.305: v52.46,29.72 52.46,36.69 v51.55,37.6 | v56.81,38.18 59.66,38.18 59.95,37.89 | 59.95,37.89 62.18,35.66 IC3.16 | v32.35,71.21 32.35,67.55 41.26,58.64 41.26,56.81 40.8,56.35 40.8,51.89 44.69,48.01 44.69,47.89 45.95,46.63 v47.43,46.63 | v68.69,39.66 61.72,39.66 59.95,37.89 | v67.32,71.55 67.32,77.38 IC8.30
  Bottom 0.305: v52.46,29.72 52.46,27.55 51.89,26.98 50.29,26.98 49.15,25.83 49.15,22.97 48.01,21.83 46.41,21.83 44.81,20.23 44.81,17.14 46.63,15.32 46.98,15.32 IC7.14 | v51.55,37.6 56.24,37.6 v56.81,38.18 | IC6.18 22.86,75.55 27.2,71.21 v32.35,71.21 | v47.43,46.63 47.78,46.63 49.26,45.15 65.04,45.15 | 65.04,45.15 68.69,41.49 v68.69,39.66 | IC4.16 81.27,35.66 79.44,35.66 78.52,36.58 76.35,36.58 72.12,32.35 72.12,26.29 71.44,25.6 68.81,25.6 63.89,30.52 63.89,33.95 62.29,35.55 IC3.16 | v67.32,71.55 67.32,64.35 65.84,62.87 65.84,58.52 63.66,56.35 63.66,52.92 65.38,51.21 66.41,51.21 67.09,50.52 67.09,47.32 65.04,45.26 65.04,45.15
D5  (via drill 0.35)
  Top 0.305: v47.66,75.78 47.66,75.32 48.58,74.41 v50.52,74.41 | v53.26,17.37 56.01,14.63 v56.01,14.52 | v57.61,24.12 59.21,24.12 60.58,25.49 60.58,25.83 61.72,26.98 63.32,26.98 64.58,28.23 v64.58,31.77 | v68.01,31.89 78.41,31.89 79.44,32.92 81.27,32.92 IC4.17 | v59.66,41.6 v59.66,53.26
  Bottom 0.305: v47.66,75.78 27.55,75.78 25.95,77.38 25.49,77.38 IC6.17 | 55.89,74.41 59.09,74.41 61.27,72.24 64.69,72.24 69.84,77.38 IC8.29 | 55.89,74.41 v50.52,74.41 | v53.26,17.37 51.89,18.75 45.83,18.75 45.26,18.17 45.26,17.37 45.83,16.8 47.55,16.8 48.69,15.66 48.69,14.86 47.09,13.26 47.09,12.8 IC7.13 | v56.01,14.52 56.01,22.52 v57.61,24.12 | 61.15,36.58 63.32,36.58 64.58,35.32 v64.58,31.77 64.69,31.89 v68.01,31.89 | 61.15,36.58 60.58,36.01 60.58,34.63 62.18,33.03 IC3.17 | 55.89,74.41 55.89,57.04 v59.66,53.26 | v59.66,41.6 59.66,38.18 61.15,36.69 61.15,36.58
D6  (via drill 0.35)
  Top 0.305: v42.29,10.52 42.63,10.17 46.98,10.17 IC7.12 | v50.41,35.09 50.18,34.86 v46.18,34.86 46.18,34.98 44.23,36.92 44.23,41.26 39.43,46.06 v39.43,48.81 | v71.21,39.09 70.87,39.09 62.29,30.52 IC3.18 | v29.72,74.64 28,76.35 28,77.38 IC6.16 | v33.95,71.67 33.95,68.81 v40.58,62.18 | v68.81,57.72 68.81,56.35 68.69,56.24 v68.69,52.46
  Bottom 0.305: v42.29,10.52 42.29,29.03 41.72,29.6 41.72,30.4 v46.18,34.86 | v50.41,35.09 53.03,35.09 56.12,32 60.69,32 62.18,30.52 IC3.18 | IC4.18 81.38,30.52 81.38,31.09 82.98,32.69 82.98,35.89 81.84,37.03 80.24,37.03 79.1,38.18 79.1,38.52 78.52,39.09 v71.21,39.09 71.21,42.63 68.35,45.49 68.35,50.75 68.69,51.09 v68.69,52.46 | v29.72,74.64 30.98,74.64 v33.95,71.67 | v40.58,62.18 40.58,58.18 39.43,57.04 v39.43,48.81 | v68.81,57.72 68.81,70.18 69.49,70.87 69.61,70.87 72.35,73.61 72.35,77.38 IC8.28
D7  (via drill 0.35)
  Top 0.305: v54.29,3.77 55.89,2.17 67.44,2.17 v73.27,8 | v84.12,27.66 81.61,27.66 81.38,27.89 IC4.19 | v28.69,49.84 24.35,54.18 24.35,64.92 30.4,70.98 30.4,77.38 IC6.15 | v31.43,10.74 31.66,10.74 33.72,8.69 36.23,8.69 38.29,6.63 44.69,6.63 45.61,7.54 46.98,7.54 IC7.11 | v88.92,61.27 88.92,62.98 74.98,76.92 74.98,77.38 IC8.27 | v84.92,51.44 84.12,50.63 v84.12,32.23
  Bottom 0.305: v54.29,3.77 52.01,3.77 48.23,7.54 47.09,7.54 IC7.11 | v73.27,8 76.92,11.66 78.52,11.66 79.55,12.69 79.55,18.17 80.7,19.32 82.41,19.32 85.84,22.75 85.84,25.95 v84.12,27.66 v84.12,32.23 | v28.69,49.84 28.69,13.49 v31.43,10.74 | IC3.19 62.29,27.89 63.55,27.89 66.64,24.8 71.32,24.8 75.78,29.26 75.78,30.86 76.47,31.55 78.52,31.55 79.1,30.98 79.1,29.95 81.04,28 81.27,28 IC4.19 | v88.92,61.27 88.92,55.44 v84.92,51.44
DX0  (via drill 0.35)
  Top 0.305: IC1.12 19.09,27.89 32.23,27.89 33.15,26.98 38.41,26.98 IC7.2 39.43,27.89 40.23,27.09 v44.58,27.09
  Bottom 0.305: v44.58,27.09 44.69,26.98 48.12,26.98 49.03,27.89 50.75,27.89 IC2.2
DX1
  Top 0.305: IC1.13 19.09,25.49 32.35,25.49 33.26,26.4 38.41,26.4 39.32,25.49 IC7.3 39.43,25.49 40.35,26.4 41.91,26.4 48.12,26.4 49.03,25.49 50.75,25.49 IC2.3
DX2
  Top 0.305: IC1.14 27.2,22.86 28.23,23.89 38.29,23.89 39.32,22.86 IC7.4 39.43,22.97 40.35,23.89 48.01,23.89 49.03,22.86 IC2.4
DX3
  Top 0.305: IC1.15 19.09,20.34 32.23,20.34 33.26,21.37 38.29,21.37 39.32,20.34 IC7.5 39.43,20.34 40.46,21.37 48.01,21.37 49.03,20.34 50.75,20.34 IC2.5
DX4
  Top 0.305: IC1.16 19.09,17.83 32.23,17.83 33.15,18.75 38.41,18.75 IC7.6 39.43,17.83 40.35,18.75 48.12,18.75 49.03,17.83 50.75,17.83 IC2.6
DX5
  Top 0.305: IC1.17 19.09,15.32 32.23,15.32 33.15,16.23 38.41,16.23 39.32,15.32 IC7.7 39.43,15.32 40.35,16.23 48.12,16.23 49.03,15.32 50.75,15.32 IC2.7
DX6
  Top 0.305: IC1.18 19.09,12.8 32.35,12.8 33.26,13.72 38.41,13.72 39.32,12.8 IC7.8 39.43,12.8 40.35,13.72 48.01,13.72 48.92,12.8 50.75,12.8 IC2.8
DX7
  Top 0.305: IC1.19 19.09,10.17 28.46,10.17 29.72,11.43 38.06,11.43 39.32,10.17 IC7.9 39.43,10.29 40.35,11.2 48.01,11.2 49.03,10.17 50.75,10.17 IC2.9
GND  (via drill 0.35)
  Top 0.61: v95.21,51.32 92.24,48.35 92.24,46.86 95.21,43.89 TP1.TP-1 | JP2.2 52.12,53.38 57.15,58.41 IC8.7 56.92,62.41 56.69,62.41 55.09,64.01 v48.81,64.01 | C11.2 45.72,42.18 51.32,36.58 51.32,34.75 50.86,34.29 50.86,30.52 IC2.1 | JP4.2 62.18,55.78 62.18,55.09 60.92,53.84 60.92,51.89 62.29,50.52 62.29,45.61 65.95,41.95 IC9.8 | IC5.7 85.04,41.83 85.04,31.89 82.3,29.15 80.24,29.15 79.32,28.23 79.32,27.55 78.52,26.75 71.21,26.75 C6.2 | IC2.10 50.75,7.54 49.61,6.4 45.38,6.4 44.12,5.14 40.69,5.14 C5.2 40.35,5.14 21.72,5.14 19.32,7.54 IC1.20 18.97,7.54 17.72,7.54 15.32,5.14 C3.- | IC1.5 19.09,45.72 19.09,43.43 IC1.6 19.09,43.09 19.09,40.92 IC1.7 19.09,40.58 19.09,38.29 IC1.8 19.09,38.06 19.09,35.78 IC1.9 19.09,35.55 19.09,33.03 IC1.10 18.75,33.03 15.2,33.03 S1.3 | IC1.39 34.29,53.38 30.52,53.38 25.49,58.41 C12.1
  Bottom 0.61: C10.1 58.42,69.85 57.15,68.58 IC8.7 57.26,61.95 62.18,57.04 62.18,55.89 JP4.2 | IC6.24 IC6.23 10.16,71.12 11.43,69.85 C8.2 20.46,69.61 20.46,64.35 21.49,63.32 21.49,59.66 | 86.36,41.91 C4.1 88.27,43.81 TP1.TP-1 | 86.36,41.91 IC5.7 | C11.2 46.99,44.45 64.77,44.45 66.04,43.18 IC9.8 66.18,41.72 66.18,40.92 70.18,36.92 70.87,36.92 71.12,36.83 | C5.2 39.37,6.35 IC7.10 | C9.1 50.8,6.35 IC2.10 | C6.2 71.12,36.83 | 71.12,36.83 72.39,38.1 IC3.14 | C7.1 88.9,36.83 90.16,38.09 | 90.16,38.09 90.17,38.1 IC4.14 | 7.62,59.69 7.62,58.42 C12.1 | 7.62,59.69 IC6.1 7.54,62.52 2.63,67.44 2.63,72.35 JP1.3 | 7.62,59.69 6.35,58.42 C1.2 C2.2 | v95.21,51.32 95.21,64.69 JP3.2 | 90.16,38.09 86.53,41.72 86.36,41.91 | 3.89,49.53 3.89,41.95 R3.2 3.77,41.6 2.74,40.58 2.74,33.03 S1.4 | IC1.5 18.97,45.72 15.2,49.49 15.24,49.53 | IC1.20 19.09,7.66 19.09,7.89 20.92,9.72 20.92,31.09 19.09,32.92 IC1.10 | v48.81,64.01 41.15,64.01 39.66,62.52 39.66,58.29 34.75,53.38 34.29,53.38 IC1.39
  pour Bottom: 0,59.69 21.59,59.69 21.59,52.07 16.51,52.07 16.51,50.8 15.24,49.53 0,49.53
  pour Bottom (no thermals): 0,80.01 100.33,80.01 100.33,0 0,0
IO/M  (via drill 0.35)
  Top 0.305: IC5.2 72.35,41.95 69.95,41.95 IC5.1 69.84,41.83 68.24,40.23 63.09,40.23 61.49,41.83 61.04,41.83 IC9.6 60.92,41.83 58.86,39.78 v56.81,39.78 | IC1.34 34.29,41.15 37.38,44.23 37.38,54.86 32.35,59.89 28.23,59.89 26.98,61.15 26.98,66.86 32.92,72.81 32.92,77.38 IC6.14 | v45.61,40.58 v47.89,38.29
  Bottom 0.305: v56.81,39.78 51.44,39.78 49.95,38.29 v47.89,38.29 | v45.61,40.58 34.29,40.58 IC1.34
M/IO
  Top 0.305: IC5.3 74.98,41.95 74.98,49.49 IC5.12
  Bottom 0.305: IC5.9 82.53,49.49 82.07,49.49 80.47,47.89 76.58,47.89 74.98,49.49 IC5.12
N$1
  Bottom 0.508: IC1.1 15.11,55.88 Q1.2 12.83,55.88 C1.1
N$2
  Bottom 0.508: IC1.2 15.11,53.34 Q1.1 9.02,52.2 C2.1
N$3
  Top 0.305: IC1.4 18.97,48.23 12.57,48.23 11.43,47.09 D2.+
N$4
  Top 0.305: D2.- R3.1
N$5
  Bottom 0.305: IC6.6 20.23,62.29 19.77,62.29 12.92,69.15 8.34,69.15 2.63,74.87 JP1.2
N$6
  Top 0.305: D1.A 2.63,2.52 6.29,2.52 R1.2 6.4,2.63 9.49,5.71 | 9.49,5.71 10.06,5.14 C3.+ 9.49,5.71 | 9.49,5.71 8.91,6.29 8.91,8.8 R2.2 8.91,9.03 8.91,12.92 17.26,21.26 17.26,28.23 17.95,28.92 19.55,28.92 20.69,30.06 20.69,31.66 34.29,45.26 IC1.36
N$7
  Top 0.305: 8.8,21.72 8.8,21.83 S1.2 | 8.8,21.72 8.8,19.09 R2.1 | S1.1 15.09,27.89 8.91,21.72 8.8,21.72
N$8
  Top 0.305: IC5.10 80.01,45.03 82.53,42.52 82.53,41.95 IC5.6
N$9
  Top 0.305: IC8.1 41.95,62.18 41.95,55.89 JP2.9
N$10
  Top 0.305: JP1.1 10.06,69.95 10.06,62.29 IC6.2
N$11
  Top 0.305: IC8.2 44.46,62.18 44.46,55.89 JP2.7
N$12
  Top 0.305: IC8.3 46.98,62.18 46.98,55.89 JP2.5
N$13
  Top 0.305: IC8.4 49.61,62.18 49.61,55.89 JP2.3
N$14
  Top 0.305: JP2.10 42.98,54.41 42.98,63.21 41.95,64.24 41.95,77.38 IC8.40
N$15
  Top 0.305: IC8.39 44.46,77.38 44.46,64.35 45.61,63.21 45.61,54.52 44.46,53.38 JP2.8
N$16
  Top 0.305: IC8.38 46.98,77.38 46.98,72.47 45.15,70.64 45.15,68.92 48.12,65.95 48.12,54.41 47.09,53.38 JP2.6
N$17
  Bottom 0.305: IC8.37 49.61,77.38 49.61,64.24 50.63,63.21 50.63,54.63 49.61,53.61 49.61,53.38 JP2.4
N$18
  Top 0.305: IC8.21 90.18,77.38 95.33,77.38 97.73,74.98 JP3.9
N$19
  Top 0.305: IC8.20 90.18,62.29 91.21,62.29 95.1,66.18 95.67,66.18 96.7,67.21 96.7,71.32 97.73,72.35 JP3.7
N$20
  Bottom 0.305: IC8.19 87.67,62.29 88.12,62.29 94.53,68.69 96.58,68.69 97.73,69.84 JP3.5
N$21
  Top 0.305: IC8.18 85.15,62.18 85.61,62.18 87.21,60.58 92.58,60.58 96.7,64.69 96.7,66.18 97.73,67.21 JP3.3
N$22
  Top 0.305: IC8.22 87.67,77.38 88.12,77.38 90.53,74.98 95.21,74.98 JP3.10
N$23
  Top 0.305: IC8.23 85.15,77.38 85.61,77.38 90.53,72.47 95.21,72.47 JP3.8
N$24
  Top 0.305: IC8.24 82.64,77.38 83.1,77.38 90.53,69.95 95.21,69.95 JP3.6
N$25
  Top 0.305: IC8.25 80.01,77.38 80.58,77.38 90.41,67.55 94.98,67.55 95.21,67.32 JP3.4
N$26
  Top 0.305: IC8.17 82.53,62.18 82.53,61.72 74.18,53.38 72.47,53.38 JP4.9
N$27
  Top 0.305: IC8.13 72.47,62.18 72.47,55.89 JP4.10
N$28
  Top 0.305: IC8.16 80.01,59.89 74.52,54.41 70.98,54.41 69.95,53.38 JP4.7
N$29
  Bottom 0.305: IC8.15 77.38,62.18 77.15,62.18 70.98,56.01 70.98,55.44 69.95,54.41 68.35,54.41 67.32,53.38 JP4.5
N$30
  Bottom 0.305: JP4.3 65.84,54.41 65.84,56.01 66.86,57.04 69.27,57.04 74.41,62.18 74.87,62.18 IC8.14
N$31
  Top 0.305: IC8.12 69.84,62.18 69.84,55.89 JP4.8
N$32
  Top 0.305: IC8.11 67.32,62.18 67.32,55.89 JP4.6
N$33
  Top 0.305: IC8.10 64.81,62.18 64.81,55.89 JP4.4
N$36
  Top 0.305: IC9.15 50.86,49.61 50.86,51.44 51.21,51.78 51.21,52.69 50.98,52.92 50.98,53.84 51.89,54.75 52.46,54.75 54.52,56.81 54.52,62.18 IC8.6
RESET  (via drill 0.35)
  Top 0.305: v48.92,73.61 50.75,73.61 IC8.35
  Bottom 0.305: v48.92,73.61 49.03,73.5 49.03,72.01 46.63,69.61 45.83,69.61 38.98,62.75 38.98,58.52 35.32,54.86 33.72,54.86 29.72,50.86 19.09,50.86 IC1.3
VCC  (via drill 0.35)
  Top 0.61: v50.52,52.35 50.52,52.01 48.35,49.84 48.35,49.61 IC9.16 | IC1.40 34.29,55.78 34.86,55.78 36.69,53.95 36.69,44.81 35.09,43.2 34.29,43.2 IC1.35 34.18,42.98 32.46,41.26 32.46,40.12 33.26,39.32 38.18,39.32 46.98,30.52 IC7.20 | JP4.1 62.29,53.26 63.09,53.26 65.04,51.32 66.86,51.32 68.58,49.61 69.84,49.61 IC5.14 | 97.73,59.89 97.73,50.06 95.33,47.66 TP1.TP-2 | 97.73,59.89 97.73,64.69 JP3.1 | 97.73,59.89 v87.67,59.89 | R1.1 6.29,12.69 2.63,12.69 D1.C | IC3.28 62.18,5.14 57.15,5.14 C9.2 | v20.46,3.89 44.58,3.89 45.72,5.03 C5.1
  Bottom 0.406: IC4.28 IC4.27
  Bottom 0.61: C10.2 76.2,69.85 77.47,71.12 | 77.47,71.12 IC8.26 | IC5.14 69.85,48.26 71.12,46.99 86.36,46.99 C4.2 88.27,47.62 TP1.TP-2 | C5.1 43.18,7.62 43.18,29.21 44.45,30.48 IC7.20 47.21,30.63 48.23,31.66 51.89,31.66 54.18,29.38 54.41,29.38 54.61,29.21 | C9.2 54.61,7.62 54.61,29.21 | 54.61,29.21 55.88,30.48 IC2.20 | C6.1 71.12,6.35 | 71.12,6.35 69.85,5.08 IC3.28 62.18,5.37 | C7.2 88.9,6.35 87.63,5.08 IC4.28 81.04,5.26 79.55,5.26 78.52,6.29 71.32,6.29 71.12,6.35 | C12.2 33.02,58.42 | 33.02,58.42 34.29,57.15 IC1.40 | C8.1 33.02,69.85 35.56,67.31 IC6.12 35.43,61.95 33.15,59.66 33.15,58.64 33.02,58.42 | IC1.35 34.29,43.2 40.58,43.2 45.49,48.12 C11.1 46.99,49.53 IC9.16 48.46,49.38 48.69,49.38 51.44,46.63 57.84,46.63 59.78,48.58 59.78,50.86 62.18,53.26 JP4.1 | v50.52,52.35 50.75,52.58 50.75,53.84 52.01,55.09 52.01,55.78 JP2.1 | v87.67,59.89 86.41,61.15 86.41,63.21 78.64,70.98 77.72,70.98 77.47,71.12 | v20.46,3.89 11.66,12.69 6.4,12.69 R1.1